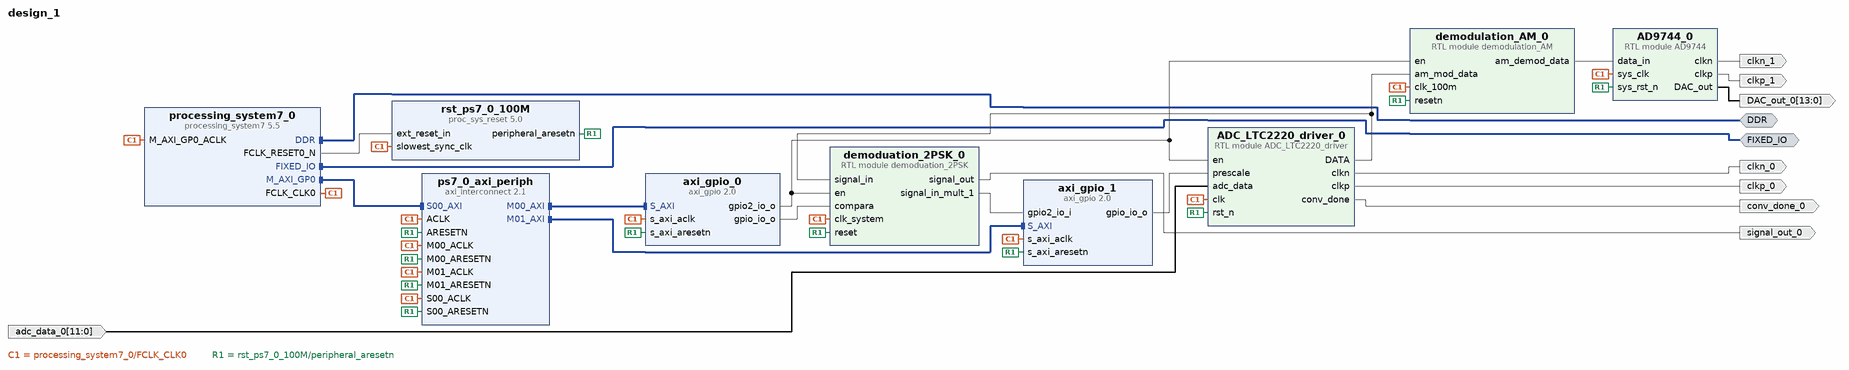
[diagram p0: block diagram of the top level]
# Vivado block design design_1, xc7z020clg400-1, Vivado 2022.2
create_bd_design design_1

create_bd_intf_port -mode Master -vlnv xilinx.com:interface:ddrx_rtl:1.0 DDR
create_bd_intf_port -mode Master -vlnv xilinx.com:display_processing_system7:fixedio_rtl:1.0 FIXED_IO
create_bd_port -dir O signal_out_0
create_bd_port -dir I -from 11 -to 0 adc_data_0
create_bd_port -dir O clkp_0
create_bd_port -dir O clkn_0
create_bd_port -dir O conv_done_0
create_bd_port -dir O -from 13 -to 0 DAC_out_0
create_bd_port -dir O clkn_1
create_bd_port -dir O clkp_1

create_bd_cell -type ip -vlnv xilinx.com:ip:processing_system7:5.5 processing_system7_0
set_property -dict [list \
  CONFIG.PCW_FPGA0_PERIPHERAL_FREQMHZ 100 \
  CONFIG.PCW_PRESET_BANK1_VOLTAGE {LVCMOS 1.8V} \
  CONFIG.PCW_QSPI_GRP_SINGLE_SS_ENABLE 1 \
  CONFIG.PCW_QSPI_GRP_SINGLE_SS_IO {MIO 1 .. 6} \
  CONFIG.PCW_QSPI_PERIPHERAL_ENABLE 1 \
  CONFIG.PCW_QSPI_QSPI_IO {MIO 1 .. 6} \
  CONFIG.PCW_SINGLE_QSPI_DATA_MODE x4 \
  CONFIG.PCW_UART0_PERIPHERAL_ENABLE 1 \
  CONFIG.PCW_UART0_UART0_IO EMIO \
  CONFIG.PCW_UART_PERIPHERAL_FREQMHZ 100 \
  CONFIG.PCW_UIPARAM_DDR_PARTNO {MT41K256M16 RE-125} \
] [get_bd_cells processing_system7_0]
# 54 more settings of processing_system7_0 are not shown: defaults, MIO pin electricals, DDR timing, and values the tool derives
create_bd_cell -type module -reference demoduation_2PSK demoduation_2PSK_0
create_bd_cell -type module -reference ADC_LTC2220_driver ADC_LTC2220_driver_0
create_bd_cell -type ip -vlnv xilinx.com:ip:axi_gpio:2.0 axi_gpio_0
set_property -dict [list \
  CONFIG.C_ALL_OUTPUTS 1 \
  CONFIG.C_ALL_OUTPUTS_2 1 \
  CONFIG.C_GPIO2_WIDTH 1 \
  CONFIG.C_IS_DUAL 1 \
] [get_bd_cells axi_gpio_0]
create_bd_cell -type ip -vlnv xilinx.com:ip:axi_interconnect:2.1 ps7_0_axi_periph
set_property -dict {CONFIG.NUM_MI 2} [get_bd_cells ps7_0_axi_periph]
create_bd_cell -type ip -vlnv xilinx.com:ip:proc_sys_reset:5.0 rst_ps7_0_100M
create_bd_cell -type ip -vlnv xilinx.com:ip:axi_gpio:2.0 axi_gpio_1
set_property -dict [list \
  CONFIG.C_ALL_INPUTS_2 1 \
  CONFIG.C_ALL_OUTPUTS 1 \
  CONFIG.C_GPIO2_WIDTH 32 \
  CONFIG.C_IS_DUAL 1 \
] [get_bd_cells axi_gpio_1]
create_bd_cell -type module -reference AD9744 AD9744_0
create_bd_cell -type module -reference demodulation_AM demodulation_AM_0

# ---- connections ----

connect_bd_intf_net [get_bd_intf_ports DDR] [get_bd_intf_pins processing_system7_0/DDR]
connect_bd_intf_net [get_bd_intf_ports FIXED_IO] [get_bd_intf_pins processing_system7_0/FIXED_IO]
connect_bd_intf_net [get_bd_intf_pins processing_system7_0/M_AXI_GP0] [get_bd_intf_pins ps7_0_axi_periph/S00_AXI]
connect_bd_intf_net [get_bd_intf_pins ps7_0_axi_periph/M00_AXI] [get_bd_intf_pins axi_gpio_0/S_AXI]
connect_bd_intf_net [get_bd_intf_pins ps7_0_axi_periph/M01_AXI] [get_bd_intf_pins axi_gpio_1/S_AXI]
connect_bd_net [get_bd_pins AD9744_0/DAC_out] [get_bd_ports DAC_out_0]
connect_bd_net [get_bd_pins AD9744_0/clkn] [get_bd_ports clkn_1]
connect_bd_net [get_bd_pins AD9744_0/clkp] [get_bd_ports clkp_1]
connect_bd_net [get_bd_pins ADC_LTC2220_driver_0/DATA] [get_bd_pins demoduation_2PSK_0/signal_in] [get_bd_pins demodulation_AM_0/am_mod_data]
connect_bd_net [get_bd_pins ADC_LTC2220_driver_0/clkn] [get_bd_ports clkn_0]
connect_bd_net [get_bd_pins ADC_LTC2220_driver_0/clkp] [get_bd_ports clkp_0]
connect_bd_net [get_bd_pins ADC_LTC2220_driver_0/conv_done] [get_bd_ports conv_done_0]
connect_bd_net -net adc_data_0_1 [get_bd_ports adc_data_0] [get_bd_pins ADC_LTC2220_driver_0/adc_data]
connect_bd_net [get_bd_pins axi_gpio_0/gpio2_io_o] \
  [get_bd_pins demoduation_2PSK_0/en] [get_bd_pins ADC_LTC2220_driver_0/en] [get_bd_pins demodulation_AM_0/en]
connect_bd_net [get_bd_pins axi_gpio_0/gpio_io_o] [get_bd_pins demoduation_2PSK_0/compara]
connect_bd_net [get_bd_pins axi_gpio_1/gpio_io_o] [get_bd_pins ADC_LTC2220_driver_0/prescale]
connect_bd_net [get_bd_pins demoduation_2PSK_0/signal_in_mult_1] [get_bd_pins axi_gpio_1/gpio2_io_i]
connect_bd_net [get_bd_pins demoduation_2PSK_0/signal_out] [get_bd_ports signal_out_0]
connect_bd_net [get_bd_pins demodulation_AM_0/am_demod_data] [get_bd_pins AD9744_0/data_in]
connect_bd_net [get_bd_pins processing_system7_0/FCLK_CLK0] \
  [get_bd_pins ADC_LTC2220_driver_0/clk] [get_bd_pins processing_system7_0/M_AXI_GP0_ACLK] \
  [get_bd_pins ps7_0_axi_periph/S00_ACLK] [get_bd_pins rst_ps7_0_100M/slowest_sync_clk] [get_bd_pins axi_gpio_0/s_axi_aclk] \
  [get_bd_pins ps7_0_axi_periph/M00_ACLK] [get_bd_pins ps7_0_axi_periph/ACLK] [get_bd_pins ps7_0_axi_periph/M01_ACLK] \
  [get_bd_pins demoduation_2PSK_0/clk_system] [get_bd_pins axi_gpio_1/s_axi_aclk] [get_bd_pins AD9744_0/sys_clk] \
  [get_bd_pins demodulation_AM_0/clk_100m]
connect_bd_net [get_bd_pins processing_system7_0/FCLK_RESET0_N] [get_bd_pins rst_ps7_0_100M/ext_reset_in]
connect_bd_net [get_bd_pins rst_ps7_0_100M/peripheral_aresetn] \
  [get_bd_pins ps7_0_axi_periph/S00_ARESETN] [get_bd_pins axi_gpio_0/s_axi_aresetn] \
  [get_bd_pins ps7_0_axi_periph/M00_ARESETN] [get_bd_pins ps7_0_axi_periph/ARESETN] \
  [get_bd_pins ps7_0_axi_periph/M01_ARESETN] [get_bd_pins demoduation_2PSK_0/reset] [get_bd_pins ADC_LTC2220_driver_0/rst_n] \
  [get_bd_pins axi_gpio_1/s_axi_aresetn] [get_bd_pins AD9744_0/sys_rst_n] [get_bd_pins demodulation_AM_0/resetn]

# ---- address map ----
assign_bd_address -offset 0x41200000 -range 64K -target_address_space [get_bd_addr_spaces processing_system7_0/Data] [get_bd_addr_segs axi_gpio_0/S_AXI/Reg]
assign_bd_address -offset 0x41210000 -range 64K -target_address_space [get_bd_addr_spaces processing_system7_0/Data] [get_bd_addr_segs axi_gpio_1/S_AXI/Reg]

validate_bd_design
save_bd_design
